# Altium schematic sheet AMU-S06-V00-IsolatedCAN4.SchDoc: Isolated CANBUS4 3V3
size A3; DrawnBy: Jonn Dillon; DocumentNumber: 6; Revision: 01; SheetNumber: 6; SheetTotal: 12; Version: 01; Project: AMU 2020 (Sourced from BMS 2020); PageSetup: Record=PageOptions|CenterHorizontal=True|CenterVertical=True|PrintScale=0.97|XCorrection=1.00|YCorrection=1.00|PrintKind=0|BorderSize=5000000|LeftOffset=0|BottomOffset=0|Orientation=2|PaperLength=1000|PaperWidth=1000|Scale=100|PaperSource=7|PrintQuality=-4|MediaType=1|DitherType=10|PaperKind=A4|PrintScaleMode=1
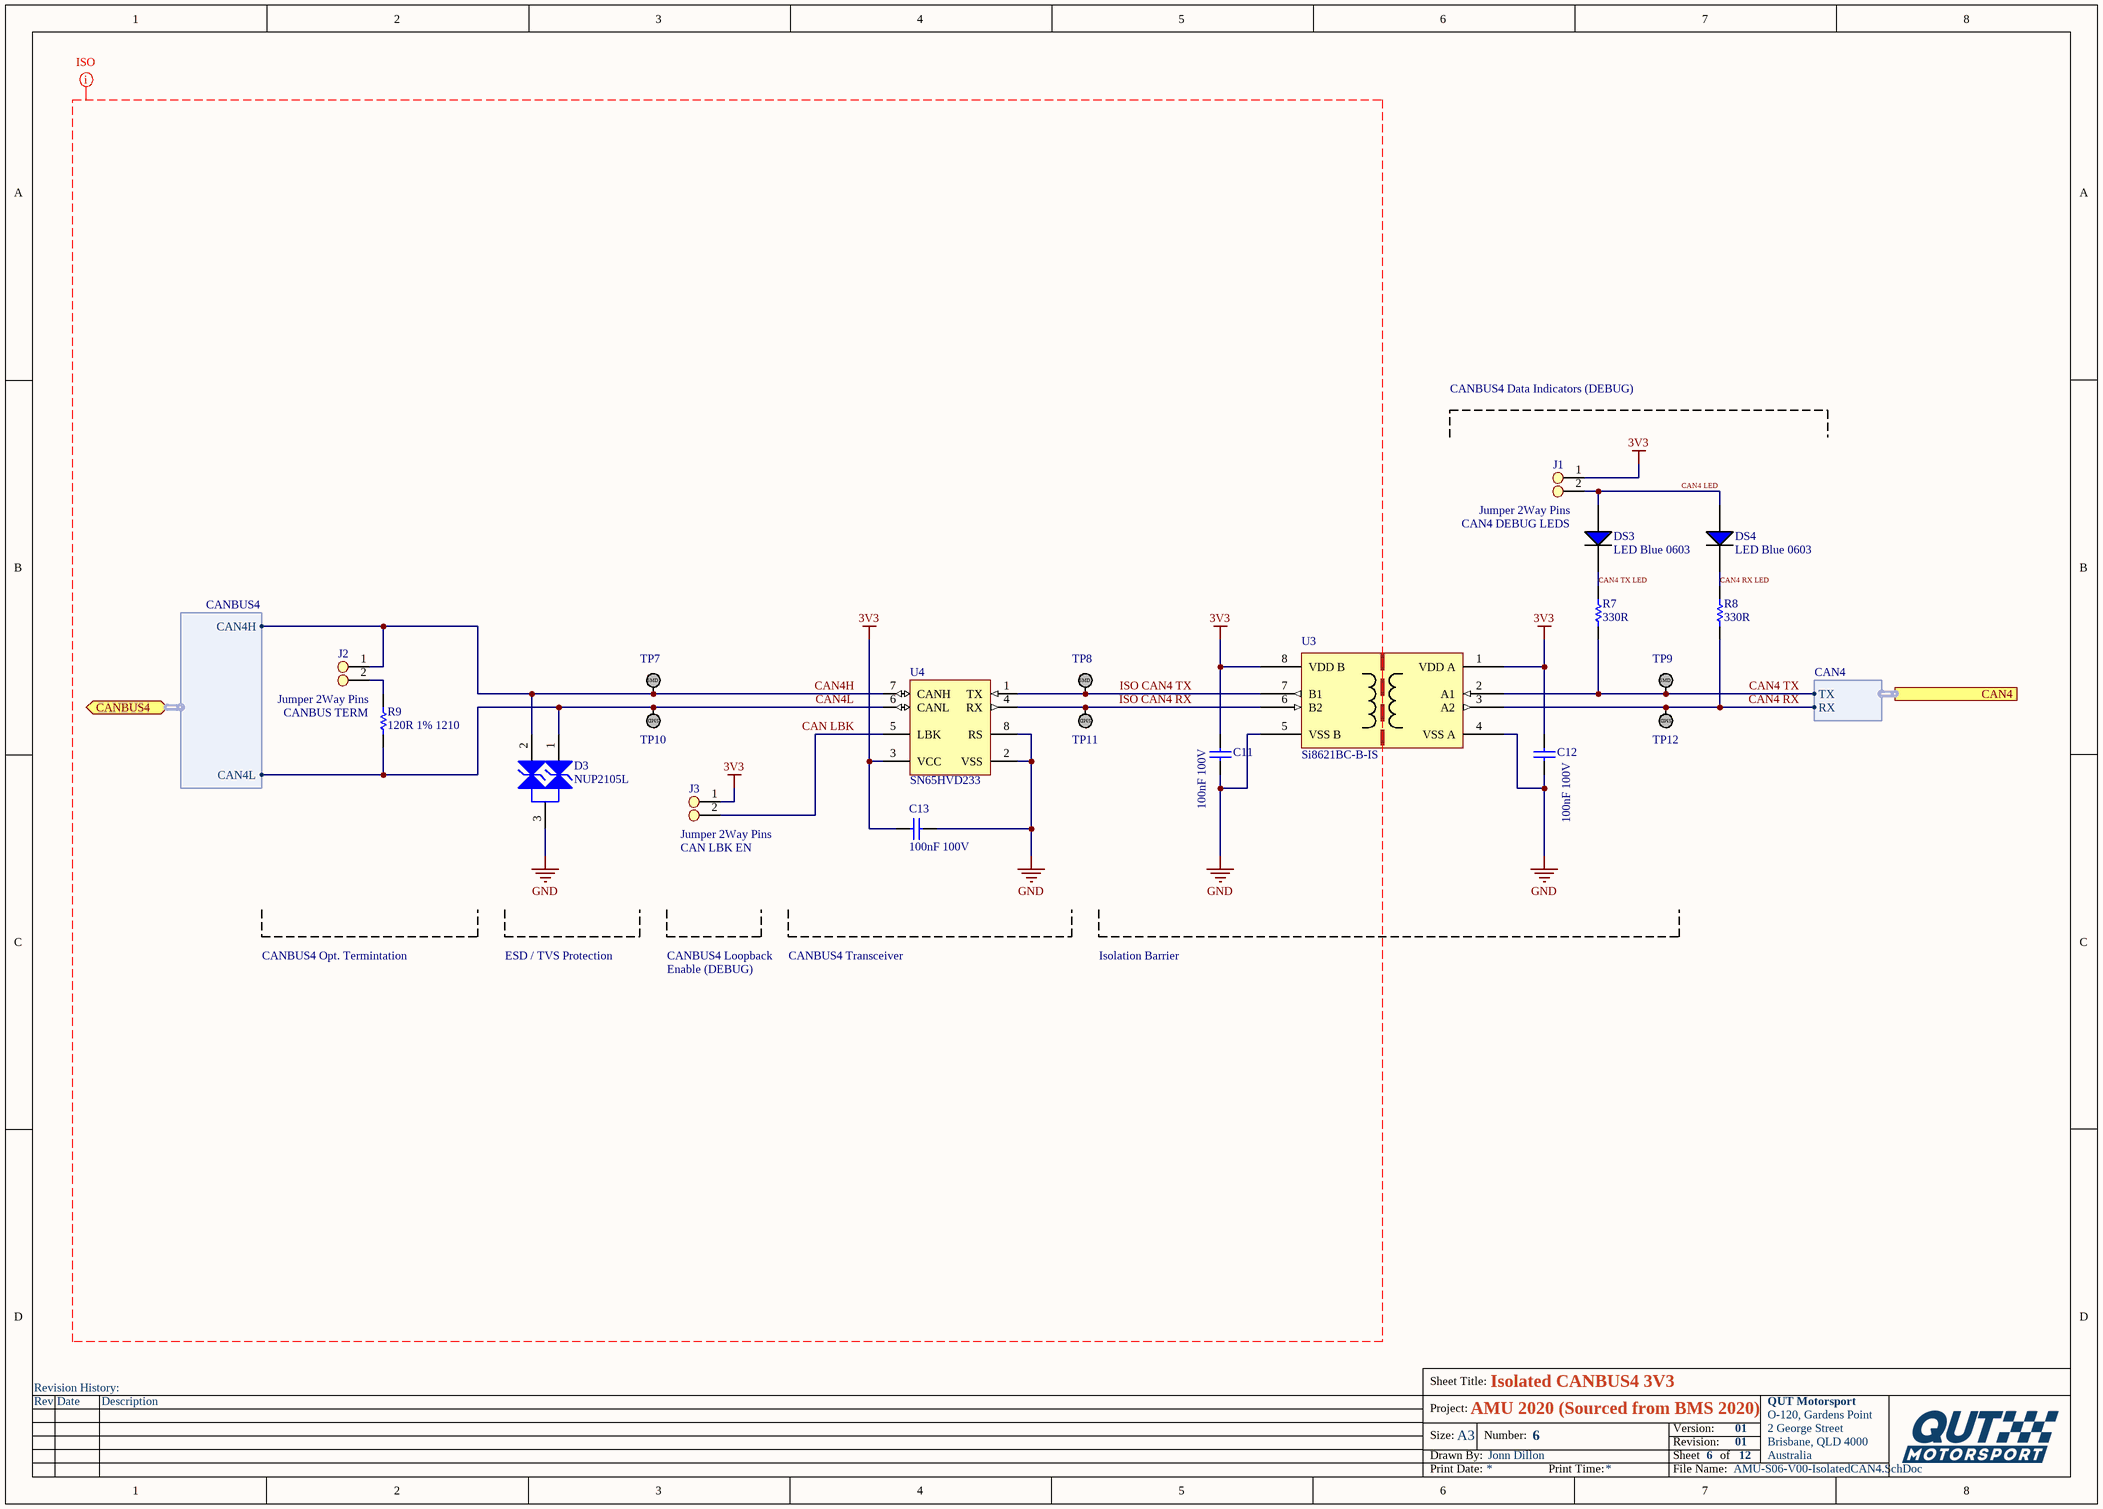
[diagram p0: AMU-S06-V00-IsolatedCAN4.SchDoc]

## Parts
C11  100nF 100V  [Cap_Ceramic_0603]
C12  100nF 100V  [Cap_Ceramic_0603]
C13  100nF 100V  [Cap_Ceramic_0603]
D3  NUP2105L  [NUP2105L]
DS3  LED Blue 0603  [LED BLUE 0603]
DS4  LED Blue 0603  [LED BLUE 0603]
J1  Jumper 2Way Pins  [Jumper_2Way_Pin]
J2  Jumper 2Way Pins  [Jumper_2Way_Pin]
J3  Jumper 2Way Pins  [Jumper_2Way_Pin]
R7  330R  [Res_ThinFilm_0603]
R8  330R  [Res_ThinFilm_0603]
R9  120R 1% 1210  [Res_ThinFilm_1210]
TP7  TestPoint_SMD  [TestPointSMD]  (value not drawn)
TP8  TestPoint_SMD  [TestPointSMD]  (value not drawn)
TP9  TestPoint_SMD  [TestPointSMD]  (value not drawn)
TP10  TestPoint_SMD  [TestPointSMD]  (value not drawn)
TP11  TestPoint_SMD  [TestPointSMD]  (value not drawn)
TP12  TestPoint_SMD  [TestPointSMD]  (value not drawn)
U3  Si8621BC-B-IS  [Si8621BC-B-IS]
U4  SN65HVD233  [SN65HVD233DR]

## Ports
CAN4 (harness CAN4), CANBUS4 (bidir, harness CANBUS4)

## Harnesses
CANBUS4: CAN4H, CAN4L
CAN4: RX, TX

## Nets
3V3: C11.2 C12.2 C13.2 J1.1 J3.1 U3.1(VDD_A) U3.8(VDD_B) U4.3(VCC)
GND: C11.1 C12.1 C13.1 D3.3 U3.4(VSS_A) U3.5(VSS_B) U4.2(VSS) U4.8(RS)
CAN4 LED: DS3.1(A) DS4.1(A) J1.2
CAN4 RX: R8.1 TP12.1 U3.3(A2) ; port CAN4.RX
CAN4 RX LED: DS4.2(C) R8.2
CAN4 TX: R7.1 TP9.1 U3.2(A1) ; port CAN4.TX
CAN4 TX LED: DS3.2(C) R7.2
CAN4H: D3.2 J2.1 TP7.1 U4.7(CANH) ; port CANBUS4.CAN4H
CAN4L: D3.1 R9.1 TP10.1 U4.6(CANL) ; port CANBUS4.CAN4L
CAN LBK: J3.2 U4.5(LBK)
ISO CAN4 RX: TP11.1 U3.6(B2) U4.4(RX)
ISO CAN4 TX: TP8.1 U3.7(B1) U4.1(TX)
NetJ2_2: J2.2 R9.2

## Layout directives
mark named ISO: 3V3, CAN4H, CAN4L, CAN LBK, GND, ISO CAN4 RX, ISO CAN4 TX

## Notes on the sheet
- CANBUS4 Data Indicators (DEBUG)
- CAN4 DEBUG LEDS
- (near R9) CANBUS TERM
- (near J3) CAN LBK EN
- CANBUS4 Opt. Termintation
- ESD / TVS Protection
- CANBUS4 Loopback
- Enable (DEBUG)
- CANBUS4 Transceiver
- Isolation Barrier
- Revision History:
- Sheet Title:
- Rev
- Date
- Description
- Project:
- Size:
- Drawn By:
- A3
- Number:
- Revision:
- Sheet
- Version:
- of
- QUT Motorsport
- O-120, Gardens Point
- 2 George Street
- Brisbane, QLD 4000
- Australia
- Print Date:
- Print Time:
- File Name:
- (in symbol TestPoint_SMD) SMD

## Library data of the parts
C11-C13 = 100nF 100V 5% X7R 0603: Capacitor, Ceramic, SMD, 100nF, 100V, 5%, X7R, 0603
J1-J3 = Jumper 2Way Side Pins
R7 R8 = 330R 5% 0603: Resistor, SMD, 330R, 0.1W, 5%, 0603
R9 = 120R 1% 1210: Resistor, SMD, 120R, 0.25W, 1%, 1210
D3 = NUP2105L: ComponentLink1Description: Datasheet; ComponentLink1URL: https://www.onsemi.cn/PowerSolutions/document/NUP2105L-D.PDF; Parameter 1: *; ComponentLink2Description: LCSC; ComponentLink2URL: https://lcsc.com/product-detail/TVS_ON-Semiconductor-NUP2105LT1G_C14486.html; ComponentLink3Description: Digikey; ComponentLink3URL: https://www.digikey.com.au/product-detail/en/on-semiconductor/SZNUP2105LT1G/SZNUP2105LT1GOSCT-ND/3487669
U3 = Si8621BC-B-IS: ComponentLink1Description: Digikey; ComponentLink1URL: https://www.digikey.com.au/product-detail/en/silicon-labs/SI8621BC-B-ISR/336-4774-1-ND/8611005; ComponentLink2Description: Datasheet; ComponentLink2URL: https://www.silabs.com/documents/public/data-sheets/si861x-2x-datasheet.pdf
U4 = SN65HVD233: ComponentLink1Description: LCSC; ComponentLink1URL: https://lcsc.com/product-detail/CAN-ICs_Texas-Instruments_SN65HVD233DRG4_Texas-Instruments-Texas-Instruments-SN65HVD233DRG4_C61643.html; ComponentLink2Description: Digikey; ComponentLink2URL: https://www.digikey.com.au/product-detail/en/texas-instruments/SN65HVD233DR/296-35967-1-ND/4134960; ComponentLink3Description: Datasheet; ComponentLink3URL: https://www.ti.com/lit/ds/symlink/sn65hvd233.pdf?ts=1588560888178; ComponentLink4Description: Ti Product Page; ComponentLink4URL: https://www.ti.com/product/SN65HVD233